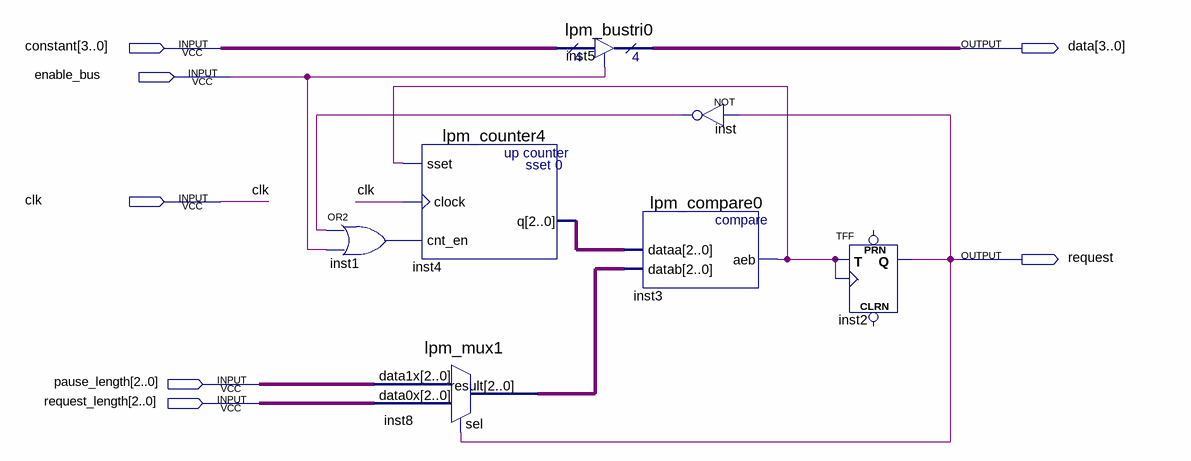
[diagram p0: schematic sheet]
// Quartus schematic Device.bdf as structural Verilog: 7 symbols, 7 pins
module Device (
  input  [3:0] constant,
  input  enable_bus,
  input  clk,
  input  [2:0] pause_length,
  input  [2:0] request_length,
  output [3:0] data,
  output request
);

  wire inst1_out, inst3_aeb, inst_out;
  wire [2:0] inst4_q, inst8_result;

  or inst1 (inst1_out, inst_out, enable_bus);
  lpm_counter4 inst4 (.sset(inst3_aeb), .clock(clk), .cnt_en(inst1_out), .q(inst4_q));
  lpm_mux1 inst8 (.data1x(pause_length), .data0x(request_length), .sel(request), .result(inst8_result));
  lpm_bustri0 inst5 (.enabledt(enable_bus), .data(constant), .tridata(data));
  lpm_compare0 inst3 (.dataa(inst4_q), .datab(inst8_result), .aeb(inst3_aeb));
  not inst (inst_out, request);
  TFF inst2 (.T(inst3_aeb), .CLK(inst3_aeb), .Q(request));  // open: PRN, CLRN
endmodule
